# EAGLE design v4smd (EAGLE 7.2.0)
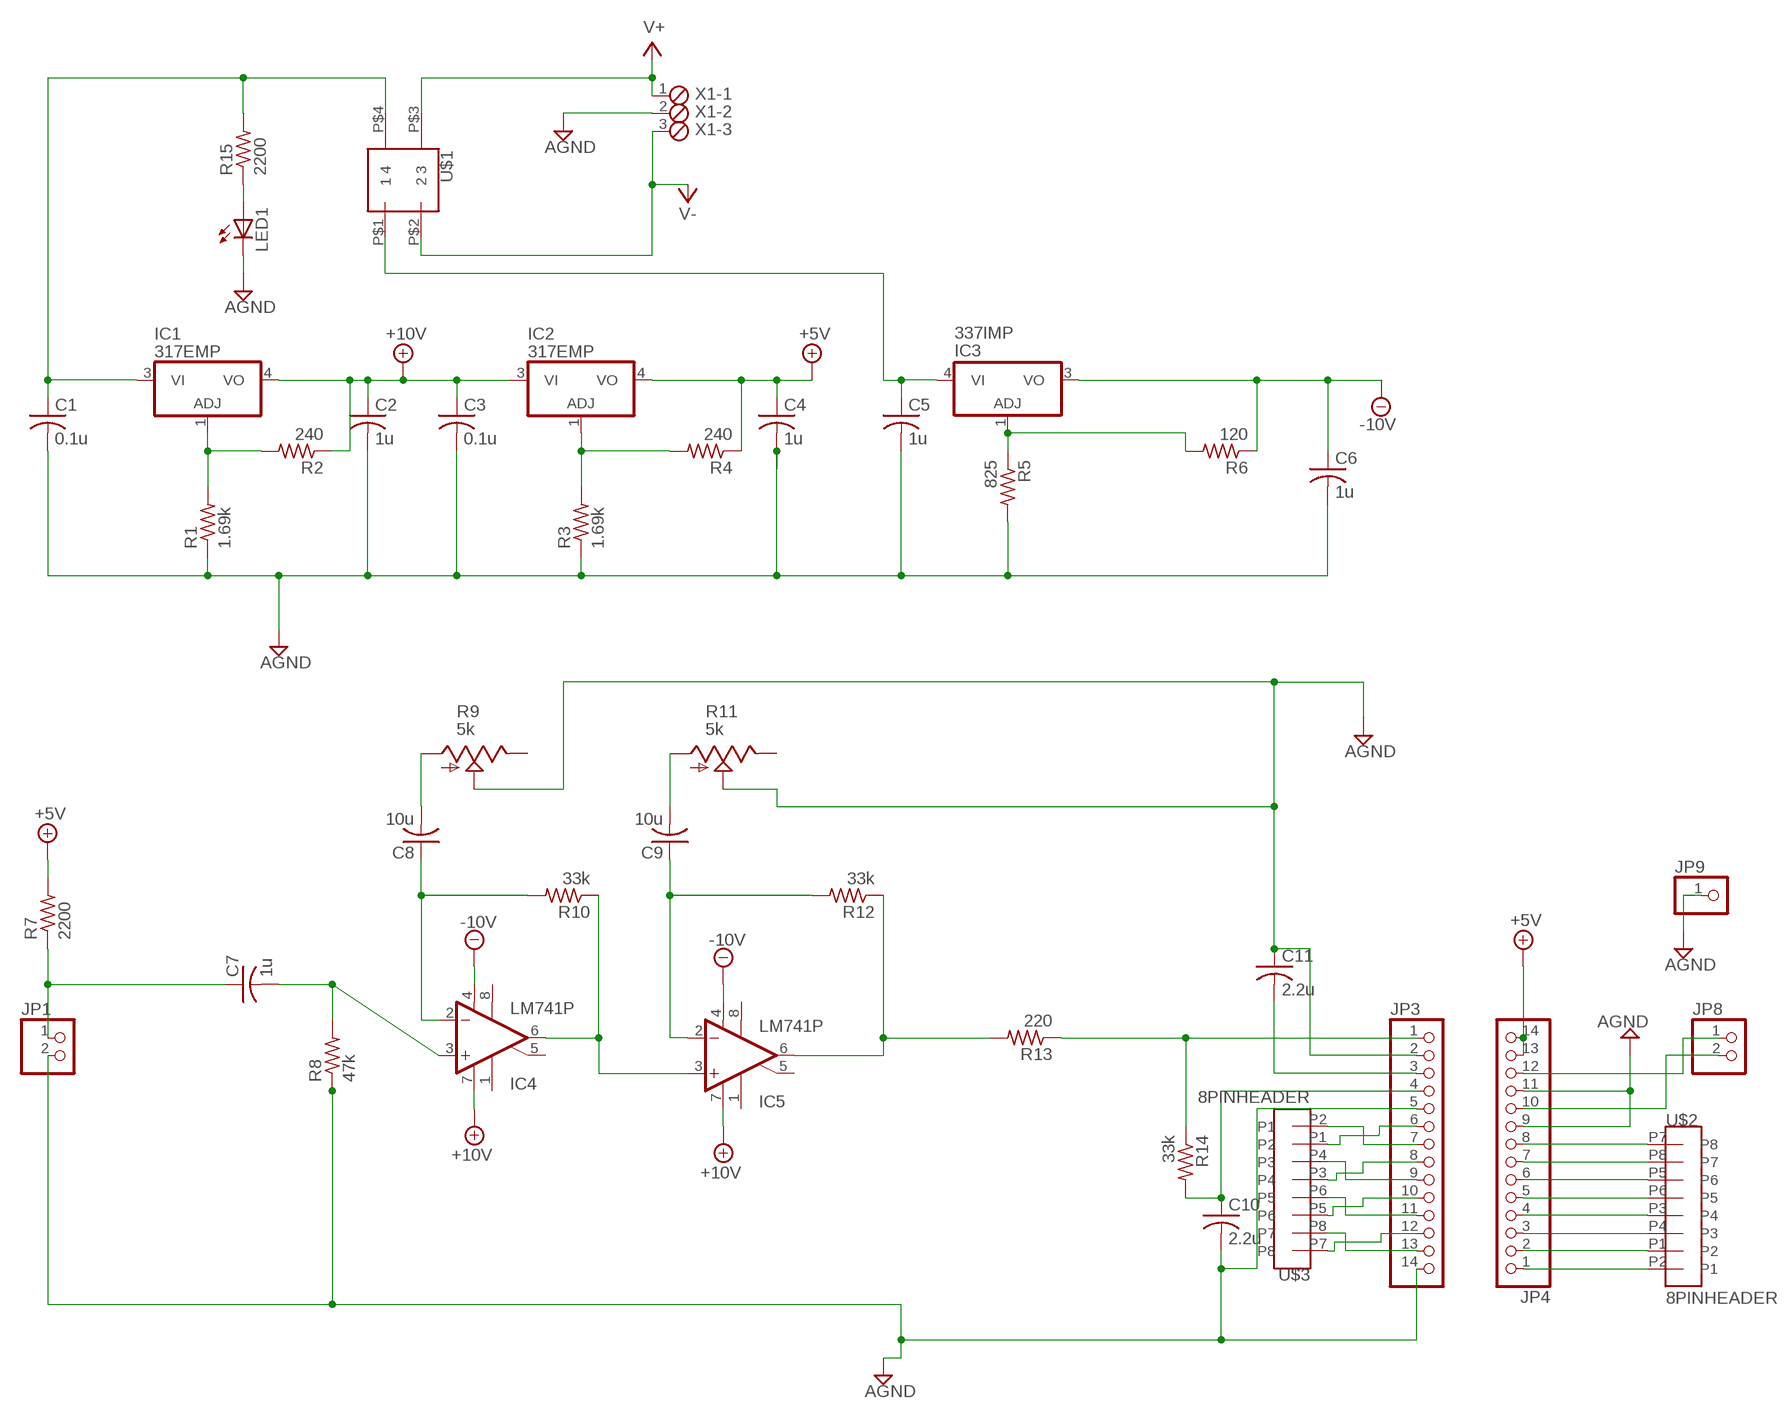
[diagram p0: schematic, sheet 1]

## Parts
C1  0.1u  C-USC1206  [C1206]
C2  1u  C-USC1206  [C1206]
C3  0.1u  C-USC1206  [C1206]
C4  1u  C-USC1206  [C1206]
C5  1u  C-USC1206  [C1206]
C6  1u  C-USC1206  [C1206]
C7  1u  C-USC1206  [C1206]
C8  10u  C-USC1206  [C1206]
C9  10u  C-USC1206  [C1206]
C10  2.2u  C-USC1206  [C1206]
C11  2.2u  C-USC1206  [C1206]
IC1  317EMP  [SOT223]
IC2  317EMP  [SOT223]
IC3  337IMP  [SOT223]
IC4  LM741P  [DIL08]
IC5  LM741P  [DIL08]
JP1  PINHD-1X2  [1X02]
JP3  PINHD-1X14  [1X14]
JP4  PINHD-1X14  [1X14]
JP8  PINHD-1X2  [1X02]
JP9  PINHD-1X1  [1X01]
LED1  LED3MM  [LED3MM]
R1  1.69k  R-US_R2512  [R2512]
R2  240  R-US_R2512  [R2512]
R3  1.69k  R-US_R2512  [R2512]
R4  240  R-US_R2512  [R2512]
R5  825  R-US_R2512  [R2512]
R6  120  R-US_R2512  [R2512]
R7  2200  R-US_R2512  [R2512]
R8  47k  R-US_R2512  [R2512]
R9  5k  TRIM_US-B64Y  [B64Y]
R10  33k  R-US_R2512  [R2512]
R11  5k  TRIM_US-B64Y  [B64Y]
R12  33k  R-US_R2512  [R2512]
R13  220  R-US_R2512  [R2512]
R14  33k  R-US_R2512  [R2512]
R15  2200  R-US_R2512  [R2512]
U$1  S201031MS02Q  [DPST_FOOTPRINT]
U$2  8PINHEADER  [2X4HEADER]
U$3  8PINHEADER  [2X4HEADER]
X1  MPT3  [3POL254]

## Nets
+5V: C4.1 IC2.4(VO) JP4.13 JP4.14 R4.1 R7.2
+10V: C2.1 C3.1 IC1.4(VO) IC2.3(VI) IC4.7(V+) IC5.7(V+) R2.1
-10V: C6.1 IC3.3(VO) IC4.4(V-) IC5.4(V-) R6.1
AGND: C1.2 C2.2 C3.2 C4.2 C5.2 C6.2 C10.2 C11.1 JP1.2 JP3.2 JP3.5 JP3.14 JP4.9 JP4.11 JP9.1 LED1.K(C) R1.1 R3.1 R5.2 R8.1 R9.S R11.S X1.2
N$1: IC4.6(OUT) IC5.3(+IN) R10.1
N$2: C7.1 JP1.1 R7.1
N$3: C7.2 IC4.3(+IN) R8.2
N$4: C8.1 IC4.2(-IN) R10.2
N$5: IC5.6(OUT) R12.1 R13.2
N$6: C9.1 IC5.2(-IN) R12.2
N$7: JP3.1 R13.1 R14.1
N$8: IC1.1(ADJ) R1.2 R2.2
N$9: IC2.1(ADJ) R3.2 R4.2
N$10: IC3.1(ADJ) R5.1 R6.2
N$11: C8.2 R9.A
N$12: JP4.1 U$2.P2(P1)
N$13: JP4.2 U$2.P1(P2)
N$14: C9.2 R11.A
N$15: C11.2 JP3.3
N$16: C10.1 JP3.4 R14.2
N$17: JP4.3 U$2.P4(P3)
N$18: JP4.4 U$2.P3(P4)
N$19: JP4.5 U$2.P6(P5)
N$20: JP4.6 U$2.P5(P6)
N$21: JP4.7 U$2.P8(P7)
N$22: JP4.8 U$2.P7(P8)
N$23: JP3.7 U$3.P2(P1)
N$24: JP3.6 U$3.P1(P2)
N$25: JP3.12 U$3.P7(P8)
N$26: JP3.13 U$3.P8(P7)
N$27: JP3.11 U$3.P6(P5)
N$28: JP3.9 U$3.P4(P3)
N$29: JP3.10 U$3.P5(P6)
N$30: JP3.8 U$3.P3(P4)
N$31: JP4.12 JP8.1
N$32: JP4.10 JP8.2
N$43: C1.1 IC1.3(VI) R15.2 U$1.P$4
N$44: C5.1 IC3.4(VI) U$1.P$1
N$45: LED1.A R15.1
V+: U$1.P$3 X1.1
V-: U$1.P$2 X1.3
Unconnected: IC4.1(ON1) IC4.5(ON2) IC4.8(OPT) IC5.1(ON1) IC5.5(ON2) IC5.8(OPT) R9.E R11.E

## Library data of the parts
C1-C11 = rcl:C-US: CAPACITOR, American symbol
IC1 IC2 = linear:*317: Positive VOLTAGE REGULATOR
IC3 = linear:*337: Negative VOLTAGE REGULATOR
IC4 IC5 = linear:*741: OP AMP
JP1 JP8 = pinhead:PINHD-1X2: PIN HEADER
JP3 JP4 = pinhead:PINHD-1X14: PIN HEADER
JP9 = pinhead:PINHD-1X1: PIN HEADER
LED1 = led:LED: LED OSRAM: - CHIPLED LG R971, LG N971, LY N971, LG Q971, LY Q971, LO R971, LY R971 LH N974, LH R974 LS Q976, LO Q976, LY Q976 LO Q996 - Hyper CHIPLED LW Q18S LB Q993, LB Q99A, LB R99A - SideLED LS A670, LO A670, LY A670, LG A670, LP A670 LB A673, LV A673, LT A673, LW A673 LH A674 LY A675 LS A676, LA A676, LO A676, LY A676, LW A676 LS A679, LY A679, LG A679 - Hyper Micro SIDELED® LS Y876, LA Y876, LO Y876, LY Y876 LT Y87S - SmartLED LW L88C, LW L88S LB L89C, LB L89S, LG L890 LS L89K, LO L89K, LY L89K LS L896, LA L896, LO L896, LY L896 - TOPLED LS T670, LO T670, LY T670, LG T670, LP T670 LSG T670, LSP T670, LSY T670, LOP T670, LYG T670 LG T671, LOG T671, LSG T671 LB T673, LV T673, LT T673, LW T673 LH T674 LS T676, LA T676, LO T676, LY T676, LB T676, LH T676, LSB T676, LW T676 LB T67C, LV T67C, LT T67C, LS T67K, LO T67K, LY T67K, LW E67C LS E67B, LA E67B, LO E67B, LY E67B, LB E67C, LV E67C, LT E67C LW T67C LS T679, LY T679, LG T679 LS T770, LO T770, LY T770, LG T770, LP T770 LB T773, LV T773, LT T773, LW T773 LH T774 LS E675, LA E675, LY E675, LS T675 LS T776, LA T776, LO T776, LY T776, LB T776 LHGB T686 LT T68C, LB T68C - Hyper Mini TOPLED® LB M676 - Mini TOPLED Santana® LG M470 LS M47K, LO M47K, LY M47K Source: http://www.osram.convergy.de LUXEON: - LUMILED® LXK2-PW12-R00, LXK2-PW12-S00, LXK2-PW14-U00, LXK2-PW14-V00 LXK2-PM12-R00, LXK2-PM12-S00, LXK2-PM14-U00 LXK2-PE12-Q00, LXK2-PE12-R00, LXK2-PE12-S00, LXK2-PE14-T00, LXK2-PE14-U00 LXK2-PB12-K00, LXK2-PB12-L00, LXK2-PB12-M00, LXK2-PB14-N00, LXK2-PB14-P00, LXK2-PB14-Q00 LXK2-PR12-L00, LXK2-PR12-M00, LXK2-PR14-Q00, LXK2-PR14-R00 LXK2-PD12-Q00, LXK2-PD12-R00, LXK2-PD12-S00 LXK2-PH12-R00, LXK2-PH12-S00 LXK2-PL12-P00, LXK2-PL12-Q00, LXK2-PL12-R00 Source: www.luxeon.com KINGBRIGHT: KA-3528ASYC Source: www.kingbright.com
R1-R8 R10 R12-R15 = rcl:R-US_: RESISTOR, American symbol
R9 R11 = pot:TRIM_US-: POTENTIOMETER
U$1 = mylib:S201031MS02Q
U$2 U$3 = mylib:8PINHEADER
X1 = con-phoenix-254:MPT3: PHOENIX CONNECTOR; OC_FARNELL: unknown; OC_NEWARK: unknown

## Net classes
0 default: clearance 0.205 mm

## Board
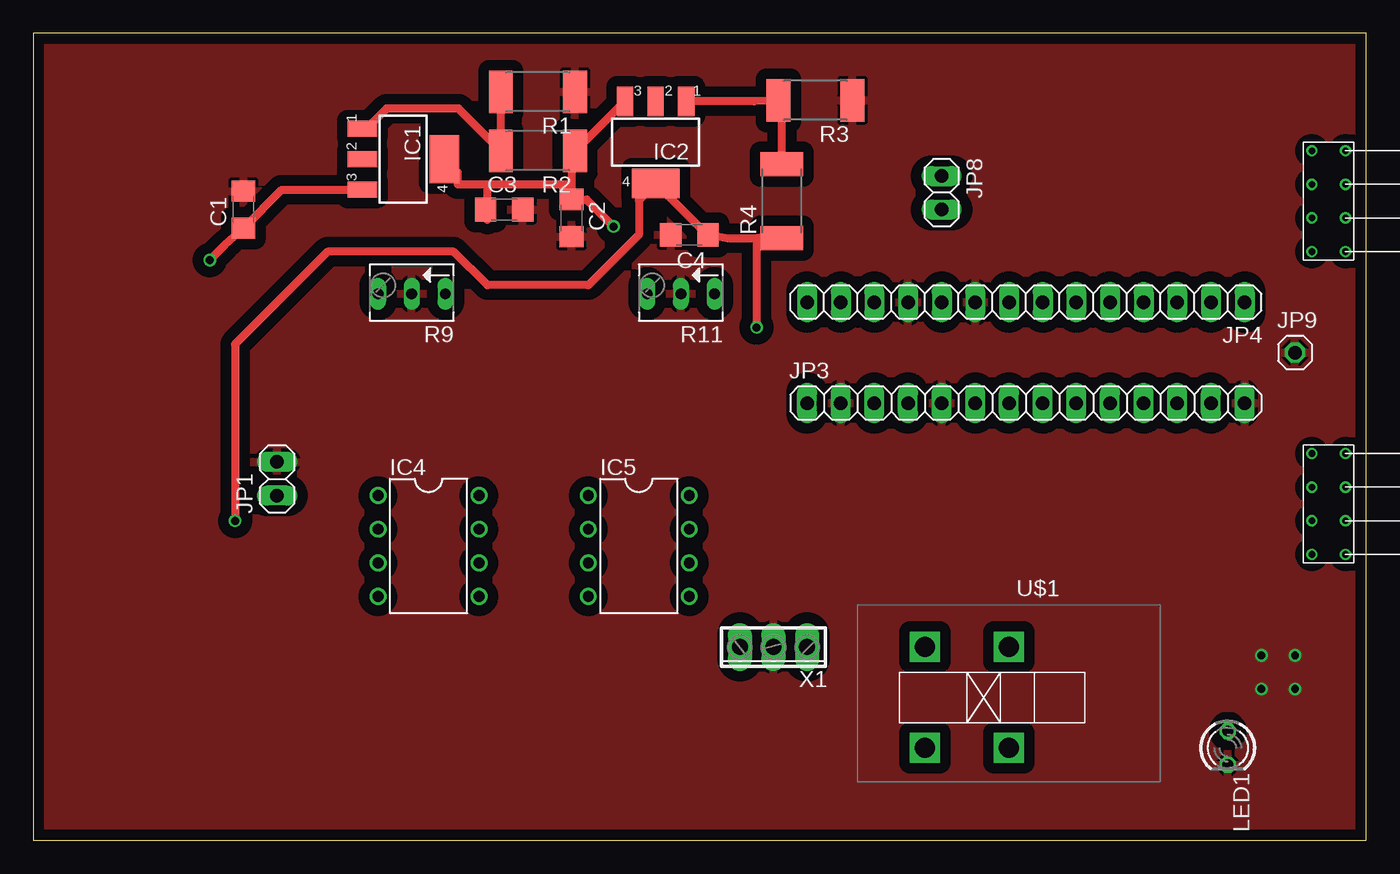
[diagram p1: board, top side]
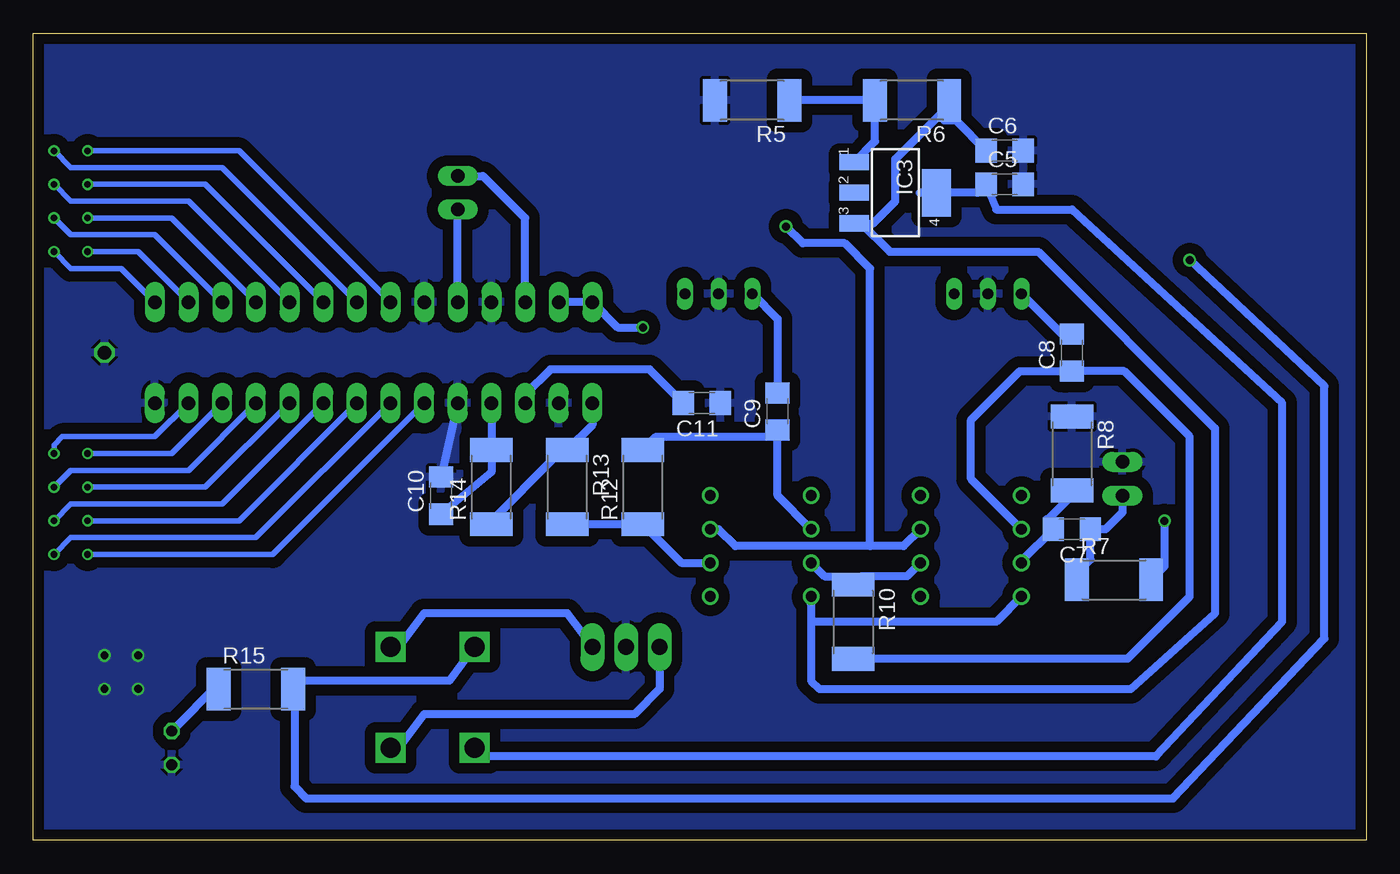
[diagram p2: board, bottom side, seen from below]

Size 100.64 x 60.95 mm. Coordinates in mm from the lower left corner, seen from the top.
Outline: 0,0 100.64,0 100.64,60.95 0,60.95 0,0
Copper layers (1*16): Top 0.0356mm / dielectric 1.5011mm / Bottom 0.0356mm
Design rules "OshPCBOrder": minimum track width 6mil, minimum drill 13mil, track to track 6mil, track to pad 6mil, pad to pad 6mil, via to via 6mil, smd to smd 6mil, copper to edge 15mil, drill to drill 6mil, minimum pad ring 7mil, minimum via ring 7mil, stop-mask expansion 3mil, vias tented up to drill 0mil, thermal gap 10mil

### Footprints (pad centres in the part's own frame; a part is rotated, then mirrored left to right if it is on the bottom)
C1206 = smd 1.6 x 1.8: 1 -1.4,0; 2 1.4,0
SOT223 = smd 1.219 x 2.235: 1 -2.311,-3.099; 2 0,-3.099; 3 2.311,-3.099 | smd 3.6 x 2.2: 4 0,3.099
DIL08 = drill 0.813 pad 1.27: 1 -3.81,-3.81; 2 -1.27,-3.81; 3 1.27,-3.81; 4 3.81,-3.81; 5 3.81,3.81; 6 1.27,3.81; 7 -1.27,3.81; 8 -3.81,3.81
1X02 = drill 1.016 long: 1 -1.27,0; 2 1.27,0
1X14 = drill 1.016 long: 1 -16.51,0; 2 -13.97,0; 3 -11.43,0; 4 -8.89,0; 5 -6.35,0; 6 -3.81,0; 7 -1.27,0; 8 1.27,0; 9 3.81,0; 10 6.35,0; 11 8.89,0; 12 11.43,0; 13 13.97,0; 14 16.51,0
1X01 = drill 1.016 octagon: 1 0,0
LED3MM = drill 0.813 octagon: A -1.27,0; K 1.27,0
R2512 = smd 1.8 x 3.2: 1 -2.8,0; 2 2.8,0
B64Y = drill 0.813 long: A 2.54,0; E -2.54,0; S 0,0
DPST_FOOTPRINT = drill 1.5 square: P$1 0,5.08; P$2 -6.35,5.08; P$3 -6.35,-2.54; P$4 0,-2.54
2X4HEADER = drill 0.5: P1 0,2.54; P2 2.54,2.54; P3 0,5.08; P4 2.54,5.08; P5 0,7.62; P6 2.54,7.62; P7 0,10.16; P8 2.54,10.16
3POL254 = drill 1.2 long: 1 -2.54,0; 2 0,0; 3 2.54,0

### Placement (x,y rotation side)
C1  15.88,47.62 90 top
C2  40.64,46.99 270 top
C3  35.56,47.62 0 top
C4  49.53,45.72 180 top
C5  27.3,49.53 0 bottom
C6  27.3,52.07 0 bottom
C7  22.23,23.5 180 bottom
C8  22.23,36.83 90 bottom
C9  44.45,32.38 90 bottom
C10  69.85,26.04 90 bottom
C11  50.16,33.02 180 bottom
IC1  27.94,51.44 270 top
IC2  46.99,52.7 180 top
IC3  35.56,48.9 270 bottom
IC4  29.84,22.23 270 top
IC5  45.72,22.23 270 top
JP1  18.41,27.3 90 top
JP3  74.93,33.02 0 top
JP4  74.93,40.64 180 top
JP8  68.58,48.9 270 top
JP9  95.25,36.83 0 top
LED1  90.17,6.99 270 top
R1  38.1,56.52 180 top
R2  38.1,52.07 180 top
R3  59.05,55.88 180 top
R4  56.52,48.26 90 top
R5  46.35,55.88 180 bottom
R6  34.29,55.88 180 bottom
R7  19.05,19.68 0 bottom
R8  22.23,29.21 270 bottom
R9  28.57,41.27 180 top
R10  38.73,16.51 270 bottom
R11  48.9,41.27 180 top
R12  54.61,26.67 90 bottom
R13  60.33,26.67 270 bottom
R14  66.04,26.67 90 bottom
R15  83.82,11.43 0 bottom
U$1  67.31,12.06 180 top
U$2  96.52,41.91 0 top
U$3  96.52,19.05 0 top
X1  55.88,14.61 180 top

### Tracks (layer width: path | path; a pad name or v marks a point on that pad's centre or on a via)
+5V  (via drill 0.6)
  Top 0.61: 54.61,45.46 52.46,45.46 C4.1 50.88,45.72 IC2.4 45.72,48.34 45.72,45.72 41.91,41.91 34.29,41.91 31.75,44.45 22.23,44.45 15.24,37.47 v15.24,24.13 | 54.61,45.46 v54.61,38.73 | R4.1 54.61,45.46
  Bottom 0.61: JP4.13 JP4.14 56.52,38.73 v54.61,38.73 | v15.24,24.13 15.24,20.7 R7.2
+10V  (via drill 0.6)
  Top 0.61: IC2.3 40.95,52.07 R2.1 40.64,51.81 40.64,49.53 | 40.64,49.53 C2.1 41.78,48.39 v43.81,46.35 | 34.29,49.53 32.05,49.53 32.05,50.42 IC1.4 | 34.29,49.53 40.64,49.53 | C3.1 34.29,46.86 34.29,49.53
  Bottom 0.61: 37.47,22.23 37.47,43.18 39.37,45.09 42.55,45.09 v43.81,46.35 | IC4.7 34.92,22.23 37.47,22.23 | 37.47,22.23 47.62,22.23 48.9,23.5 IC5.7
-10V
  Bottom 0.61: R6.1 31.62,55.38 | 31.62,55.38 31.88,54.37 31,54.37 C6.1 | IC3.3 38.1,46.58 | 38.1,46.58 37.24,46.58 35.56,48.26 35.56,51.44 31.62,55.38 | 41.91,17.78 IC5.4 41.91,16.51 | 41.91,16.51 41.91,12.06 41.27,11.43 17.78,11.43 11.43,17.14 11.43,31.11 24.77,44.45 35.97,44.45 38.1,46.58 | IC4.4 27.94,16.51 41.91,16.51
AGND  (via drill 0.6)
  Bottom 0.61: JP3.5 C10.2
  other vias: 92.71,13.97 95.25,13.97 92.71,11.43 95.25,11.43
  pour Top (isolate 0.813): 0,60.96 0,0 102.23,0 102.87,60.96
  pour Bottom (isolate 0.813): -0.64,61.59 -0.64,0 103.5,0 103.5,61.59
N$1
  Bottom 0.61: R10.1 38.1,19.95 | IC4.6 34.66,19.95 38.1,19.95 | IC5.3 40.9,19.95 38.1,19.95
N$2
  Bottom 0.61: R7.1 22.09,19.93 20.82,21.2 C7.1 19.68,23.5 18.41,24.77 JP1.1
N$3
  Bottom 0.61: R8.2 22.23,26.04 24,24.26 24.13,24.26 C7.2 26.04,21.09 IC4.3
N$4
  Bottom 0.61: 39.37,13.97 R10.2 | 38.73,13.97 R10.2 | C8.1 18.29,35.43 13.34,30.48 13.34,18.41 18.04,13.71 R10.2 | C8.1 22.73,34.92 | C8.1 26.16,35.43 29.84,31.75 29.84,27.3 IC4.2
N$5
  Bottom 0.61: R13.2 R12.1 51.7,20.95 IC5.6
N$6
  Bottom 0.61: IC5.2 44.45,26.04 44.45,30.48 | 44.45,30.48 C9.1 | R12.2 53.6,30.48 44.45,30.48
N$7
  Bottom 0.61: JP3.1 58.42,31.38 R13.1 60.7,29.47 66.67,23.5 66.42,23.5 R14.1
N$8
  Top 0.61: R1.2 R2.2 32.12,55.24 26.67,55.24 25.17,53.75 IC1.1
N$9
  Top 0.61: IC2.1 54.43,55.8 R3.2 56.52,55.62 R4.2
N$10
  Bottom 0.61: R5.1 R6.2 37.09,52.77 IC3.1
N$11
  Bottom 0.61: C8.2 22.99,38.23 R9.A
N$12
  Bottom 0.406: JP4.1 93.98,43.18 97.79,43.18 U$2.P2
N$13
  Bottom 0.406: JP4.2 92.71,44.45 U$2.P1
N$14
  Bottom 0.61: R11.A 44.45,39.37 C9.2
N$15
  Bottom 0.61: C11.2 54.1,35.56 61.59,35.56 63.5,33.66 JP3.3
N$16
  Bottom 0.61: JP3.4 R14.2 66.04,27.81 C10.1
N$17
  Bottom 0.406: JP4.3 91.44,45.72 97.79,45.72 U$2.P4
N$18
  Bottom 0.406: JP4.4 90.17,46.99 U$2.P3
N$19
  Bottom 0.406: JP4.5 88.9,48.26 97.79,48.26 U$2.P6
N$20
  Bottom 0.406: JP4.6 87.63,49.53 U$2.P5
N$21
  Bottom 0.406: JP4.7 86.36,50.8 97.79,50.8 U$2.P8
N$22
  Bottom 0.406: JP4.8 85.09,52.07 U$2.P7
N$23
  Bottom 0.406: JP3.7 83.82,22.86 97.79,22.86 U$3.P2
N$24
  Bottom 0.406: JP3.6 82.55,21.59 U$3.P1
N$25
  Bottom 0.406: JP3.12 90.17,29.21 U$3.P7
N$26
  Bottom 0.406: JP3.13 91.44,30.48 98.42,30.48 99.06,29.84 U$3.P8
N$27
  Bottom 0.406: JP3.11 88.9,27.94 97.79,27.94 U$3.P6
N$28
  Bottom 0.406: JP3.9 86.36,25.4 97.79,25.4 U$3.P4
N$29
  Bottom 0.406: JP3.10 87.63,26.67 U$3.P5
N$30
  Bottom 0.406: JP3.8 85.09,24.13 U$3.P3
N$31
  Bottom 0.61: JP4.12 63.5,46.99 66.67,50.16 JP8.1
N$32
  Bottom 0.61: JP4.10 JP8.2
N$43  (via drill 0.6)
  Top 0.61: v13.34,43.81 14.47,44.95 C1.1 18.77,49.12 IC1.3
  Bottom 0.61: v13.34,43.81 3.17,34.29 3.17,15.24 14.61,3.17 80.01,3.17 80.91,4.07 80.91,11.05 81.28,11.43 R15.2 81.02,12.44 81.28,12.06 69.22,12.06 U$1.P$4
N$44
  Bottom 0.61: 33.73,48.9 IC3.4 29.34,48.9 C5.1 27.94,47.62 22.23,47.62 6.35,33.02 6.35,16.51 15.88,6.35 67.31,6.35 U$1.P$1
N$45
  Bottom 0.61: R15.1 86.62,11.8 LED1.A
V+
  Bottom 0.61: X1.1 60.33,17.14 71.12,17.14 73.03,14.61 U$1.P$3
V-
  Bottom 0.61: U$1.P$2 73.03,6.99 71.12,9.53 55.24,9.53 53.34,11.43 X1.3